# EAGLE design PIC18F4550 Ref3-Mod (EAGLE 7.3.0)
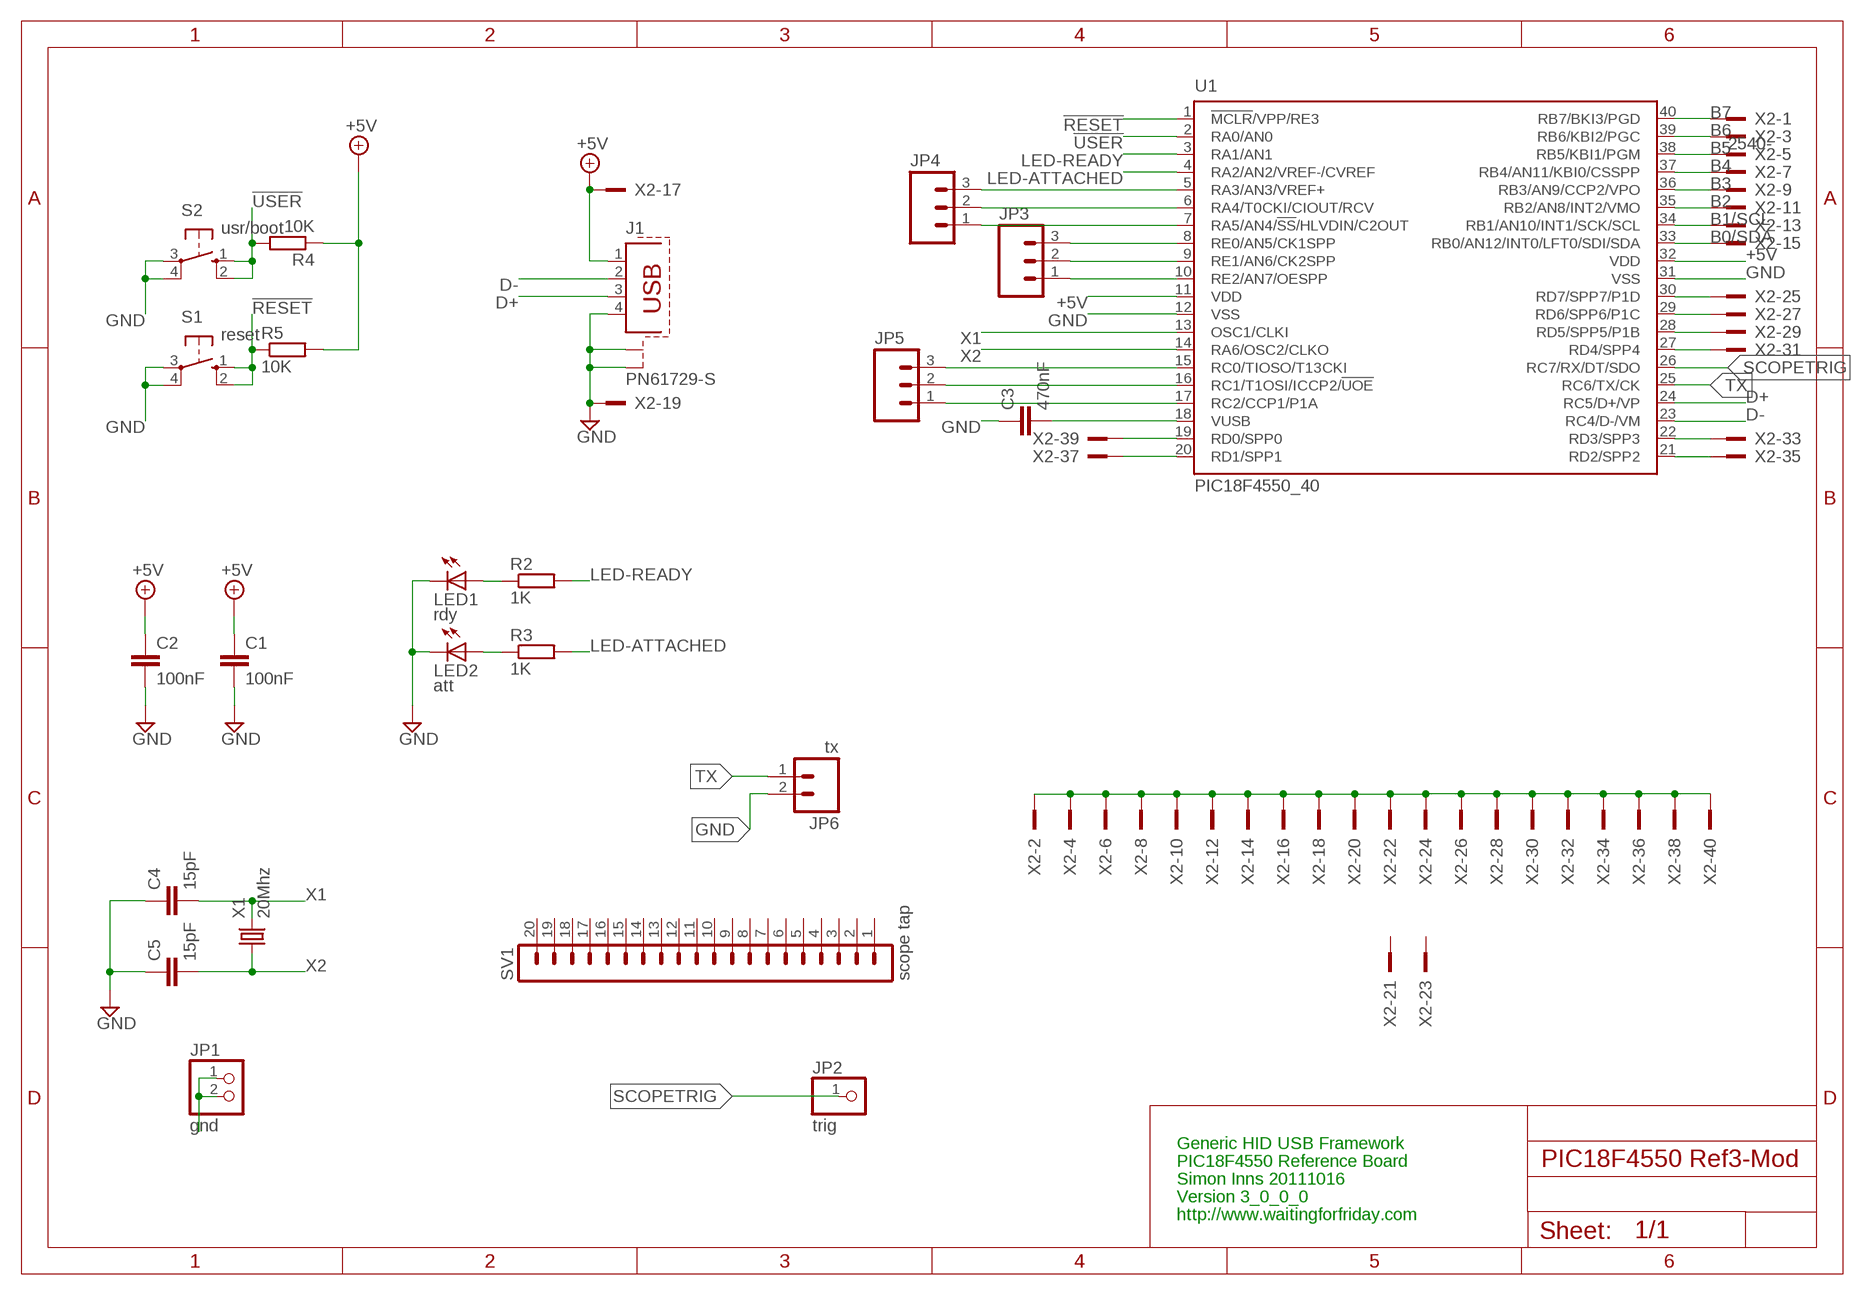
[diagram p0: schematic, sheet 1]

## Parts
C1  100nF  C-EU025-025X050  [C025-025X050]
C2  100nF  C-EU025-025X050  [C025-025X050]
C3  470nF  C-EU025-025X050  [C025-025X050]
C4  15pF  C-EU050-024X044  [C050-024X044]
C5  15pF  C-EU050-024X044  [C050-024X044]
J1  PN61729-S  [PN61729-S]
JP1  gnd  PINHD-1X2  [1X02]
JP2  trig  PINHD-1X1  [1X01]
JP3  M03PTH  [1X03]
JP4  M03PTH  [1X03]
JP5  M03PTH  [1X03]
JP6  tx  M02PTH  [1X02]
LED1  rdy  LED3MM  [LED3MM]
LED2  att  LED3MM  [LED3MM]
R2  1K  R-EU_0207/10  [0207/10]
R3  1K  R-EU_0207/10  [0207/10]
R4  10K  R-EU_0207/10  [0207/10]
R5  10K  R-EU_0207/10  [0207/10]
S1  reset  10-XX  [B3F-10XX]
S2  usr/boot  10-XX  [B3F-10XX]
SV1  scope tap  MA20-1  [MA20-1]
U1  PIC18F4550_40  [DIL40]
X1  20Mhz  CRYSTALHC49U-V  [HC49U-V]
X2  2540-  [PAK100/2500-40]

## Nets
!RESET: R5.1 S1.1(S) S1.2(S1) U1.1(!MCLR!/VPP/RE3)
!USER: R4.2 S2.1(S) S2.2(S1) U1.2(RA0/AN0)
+5V: C1.1 C2.1 J1.1 R4.1 R5.2 U1.11(VDD) U1.32(VDD) X2.17
B0/SDA: U1.33(RB0/AN12/INT0/LFT0/SDI/SDA) X2.15
B1/SCL: U1.34(RB1/AN10/INT1/SCK/SCL) X2.13
B2: U1.35(RB2/AN8/INT2/VMO) X2.11
B3: U1.36(RB3/AN9/CCP2/VPO) X2.9
B4: U1.37(RB4/AN11/KBI0/CSSPP) X2.7
B5: U1.38(RB5/KBI1/PGM) X2.5
B6: U1.39(RB6/KBI2/PGC) X2.3
B7: U1.40(RB7/BKI3/PGD) X2.1
D+: J1.3 U1.24(RC5/D+/VP)
D-: J1.2 U1.23(RC4/D-/VM)
GND: C1.2 C2.2 C3.1 C4.1 C5.1 J1.4 J1.S1 J1.S2 JP1.1 JP1.2 JP6.2 LED1.K(C) LED2.K(C) S1.3(P) S1.4(P1) S2.3(P) S2.4(P1) U1.12(VSS) U1.31(VSS) X2.2 X2.4 X2.6 X2.8 X2.10 X2.12 X2.14 X2.16 X2.18 X2.19 X2.20 X2.22 X2.24 X2.26 X2.28 X2.30 X2.32 X2.34 X2.36 X2.38 X2.40
LED-ATTACHED: R3.2 U1.4(RA2/AN2/VREF-/CVREF)
LED-READY: R2.2 U1.3(RA1/AN1)
N$1: U1.19(RD0/SPP0) X2.39
N$2: LED1.A R2.1
N$3: LED2.A R3.1
N$4: U1.20(RD1/SPP1) X2.37
N$5: U1.30(RD7/SPP7/P1D) X2.25
N$6: U1.29(RD6/SPP6/P1C) X2.27
N$7: U1.28(RD5/SPP5/P1B) X2.29
N$8: U1.27(RD4/SPP4) X2.31
N$9: U1.22(RD3/SPP3) X2.33
N$10: U1.21(RD2/SPP2) X2.35
N$11: C3.2 U1.18(VUSB)
N$12: JP3.1 U1.10(RE2/AN7/OESPP)
N$13: JP3.2 U1.9(RE1/AN6/CK2SPP)
N$14: JP3.3 U1.8(RE0/AN5/CK1SPP)
N$15: JP4.1 U1.7(RA5/AN4/!SS!/HLVDIN/C2OUT)
N$16: JP4.2 U1.6(RA4/T0CKI/CIOUT/RCV)
N$17: JP4.3 U1.5(RA3/AN3/VREF+)
N$18: JP5.1 U1.17(RC2/CCP1/P1A)
N$19: JP5.2 U1.16(RC1/T1OSI/ICCP2/!UOE)
N$20: JP5.3 U1.15(RC0/TIOSO/T13CKI)
SCOPETRIG: JP2.1 U1.26(RC7/RX/DT/SDO)
TX: JP6.1 U1.25(RC6/TX/CK)
X1: C4.2 U1.13(OSC1/CLKI) X1.2
X2: C5.2 U1.14(RA6/OSC2/CLKO) X1.1
Unconnected: SV1.1 SV1.2 SV1.3 SV1.4 SV1.5 SV1.6 SV1.7 SV1.8 SV1.9 SV1.10 SV1.11 SV1.12 SV1.13 SV1.14 SV1.15 SV1.16 SV1.17 SV1.18 SV1.19 SV1.20 X2.21 X2.23

## Notes on the sheet
- Generic HID USB Framework
- PIC18F4550 Reference Board
- Simon Inns 20111016
- Version 3_0_0_0
- http://www.waitingforfriday.com

## Library data of the parts
C1-C5 = rcl:C-EU: CAPACITOR, European symbol
J1 = con-berg:PN61729-S: BERG USB connector; OC_FARNELL: unknown; OC_NEWARK: unknown
JP1 = pinhead:PINHD-1X2: PIN HEADER
JP2 = pinhead:PINHD-1X1: PIN HEADER
JP3-JP5 = SparkFun:M03: Header 3 Standard 3-pin 0.1" header. Use with straight break away headers (SKU : PRT-00116), right angle break away headers (PRT-00553), swiss pins (PRT-00743), machine pins (PRT-00117), and female headers (PRT-00115). Molex polarized connector foot print use with SKU : PRT-08232 with associated crimp pins and housings.
JP6 = SparkFun:M02: Header 2 Standard 2-pin 0.1" header. Use with straight break away headers (SKU : PRT-00116), right angle break away headers (PRT-00553), swiss pins (PRT-00743), machine pins (PRT-00117), and female headers (PRT-00115). Molex polarized connector foot print use with SKU : PRT-08233 with associated crimp pins and housings.
LED1 LED2 = led:LED: LED OSRAM: - CHIPLED LG R971, LG N971, LY N971, LG Q971, LY Q971, LO R971, LY R971 LH N974, LH R974 LS Q976, LO Q976, LY Q976 LO Q996 - Hyper CHIPLED LW Q18S LB Q993, LB Q99A, LB R99A - SideLED LS A670, LO A670, LY A670, LG A670, LP A670 LB A673, LV A673, LT A673, LW A673 LH A674 LY A675 LS A676, LA A676, LO A676, LY A676, LW A676 LS A679, LY A679, LG A679 - Hyper Micro SIDELED® LS Y876, LA Y876, LO Y876, LY Y876 LT Y87S - SmartLED LW L88C, LW L88S LB L89C, LB L89S, LG L890 LS L89K, LO L89K, LY L89K LS L896, LA L896, LO L896, LY L896 - TOPLED LS T670, LO T670, LY T670, LG T670, LP T670 LSG T670, LSP T670, LSY T670, LOP T670, LYG T670 LG T671, LOG T671, LSG T671 LB T673, LV T673, LT T673, LW T673 LH T674 LS T676, LA T676, LO T676, LY T676, LB T676, LH T676, LSB T676, LW T676 LB T67C, LV T67C, LT T67C, LS T67K, LO T67K, LY T67K, LW E67C LS E67B, LA E67B, LO E67B, LY E67B, LB E67C, LV E67C, LT E67C LW T67C LS T679, LY T679, LG T679 LS T770, LO T770, LY T770, LG T770, LP T770 LB T773, LV T773, LT T773, LW T773 LH T774 LS E675, LA E675, LY E675, LS T675 LS T776, LA T776, LO T776, LY T776, LB T776 LHGB T686 LT T68C, LB T68C - Hyper Mini TOPLED® LB M676 - Mini TOPLED Santana® LG M470 LS M47K, LO M47K, LY M47K Source: http://www.osram.convergy.de LUXEON: - LUMILED® LXK2-PW12-R00, LXK2-PW12-S00, LXK2-PW14-U00, LXK2-PW14-V00 LXK2-PM12-R00, LXK2-PM12-S00, LXK2-PM14-U00 LXK2-PE12-Q00, LXK2-PE12-R00, LXK2-PE12-S00, LXK2-PE14-T00, LXK2-PE14-U00 LXK2-PB12-K00, LXK2-PB12-L00, LXK2-PB12-M00, LXK2-PB14-N00, LXK2-PB14-P00, LXK2-PB14-Q00 LXK2-PR12-L00, LXK2-PR12-M00, LXK2-PR14-Q00, LXK2-PR14-R00 LXK2-PD12-Q00, LXK2-PD12-R00, LXK2-PD12-S00 LXK2-PH12-R00, LXK2-PH12-S00 LXK2-PL12-P00, LXK2-PL12-Q00, LXK2-PL12-R00 Source: www.luxeon.com KINGBRIGHT: KA-3528ASYC Source: www.kingbright.com
R2-R5 = rcl:R-EU_: RESISTOR, European symbol
S1 S2 = switch-omron:10-XX: OMRON SWITCH; MPN: B3F-1000; OC_FARNELL: 176432; OC_NEWARK: 36M3542
SV1 = con-lstb:MA20-1: PIN HEADER; OC_FARNELL: unknown; OC_NEWARK: unknown
U1 = microchip:PIC18F4*_40: USB Microcontrollers with nanoWatt Technology High-Performance, Enhanced Flash, 28/40/44-Pin, Source: http://ww1.microchip.com/downloads/en/devicedoc/39632c.pdf; MF: MICROCHIP; MPN: PIC18F4550-I/P; OC_FARNELL: 9321357; OC_NEWARK: 74K8623
X1 = crystal:CRYSTAL: CRYSTAL; OC_FARNELL: 1666969; OC_NEWARK: unknown
X2 = con-3m:2540-: 3M (TM) Pak 100 4-Wall Header Source: 3M; OC_FARNELL: unknown; OC_NEWARK: unknown

## Board
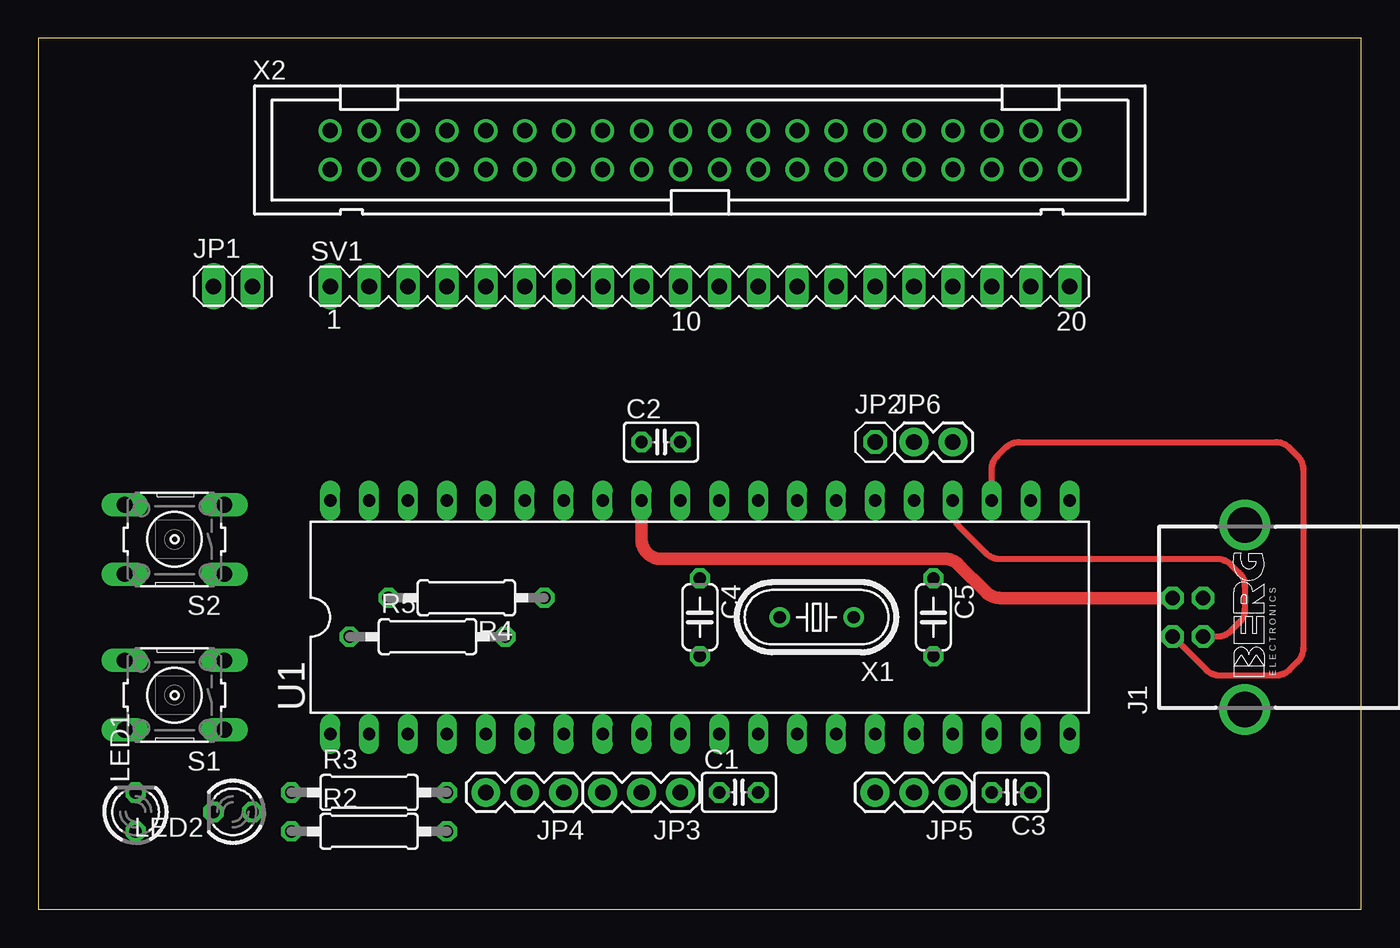
[diagram p1: board, top side]
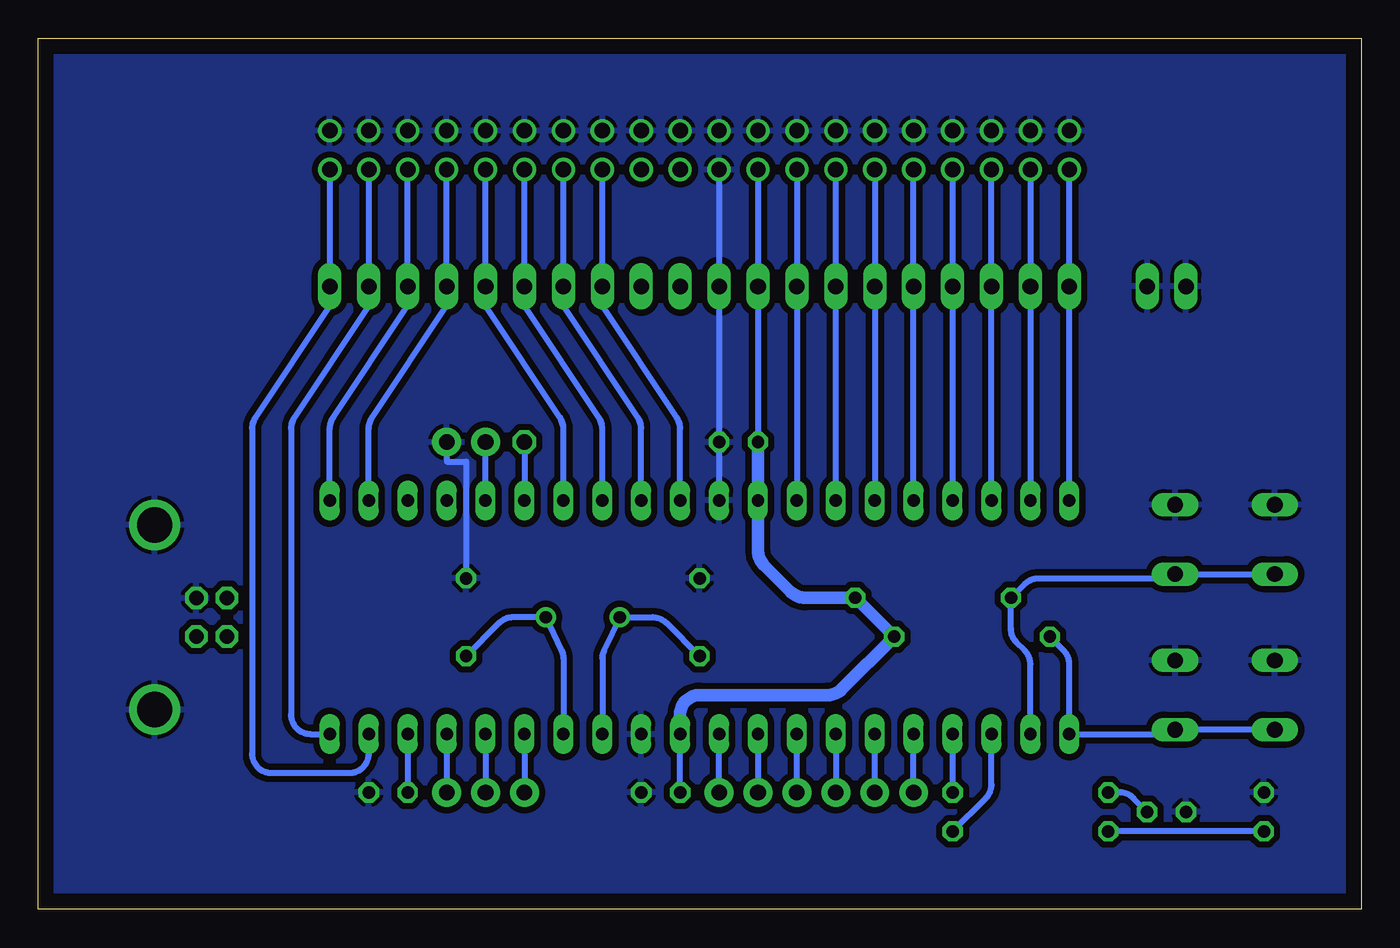
[diagram p2: board, bottom side, seen from below]

Size 86.34 x 56.82 mm. Coordinates in mm from the lower left corner, seen from the top.
Outline: 0,0 86.34,0 86.34,56.82 0,56.82 0,0
Copper layers (1*16): Top 0.035mm / dielectric 1.5mm / Bottom 0.035mm
Design rules "default": minimum track width 10mil, minimum drill 24mil, track to track 8mil, track to pad 8mil, pad to pad 8mil, via to via 8mil, smd to smd 8mil, copper to edge 40mil, drill to drill 8mil, minimum pad ring 10mil, minimum via ring 8mil, stop-mask expansion 4mil, vias tented up to drill 0mil, thermal gap 10mil

### Footprints (pad centres in the part's own frame; a part is rotated, then mirrored left to right if it is on the bottom)
C025-025X050 = drill 0.813 octagon: 1 -1.27,0; 2 1.27,0
C050-024X044 = drill 0.813 octagon: 1 -2.54,0; 2 2.54,0
PN61729-S = drill 0.95 octagon: 1 1.25,4.71; 2 -1.25,4.71; 3 -1.25,2.71; 4 1.25,2.71 | drill 2.3 pad 2.9: S1 -6.02,0; S2 6.02,0
1X02 = drill 1.016 long: 1 -1.27,0; 2 1.27,0
1X01 = drill 1.016 octagon: 1 0,0
1X03 = drill 1.016 pad 1.88: 1 0,0; 2 2.54,0; 3 5.08,0
1X02' = drill 1.016 pad 1.88: 1 0,0; 2 2.54,0
LED3MM = drill 0.813 octagon: A -1.27,0; K 1.27,0
0207/10 = drill 0.813 octagon: 1 -5.08,0; 2 5.08,0
B3F-10XX = drill 1.016 long: 1 -3.251,2.261; 2 3.251,2.261; 3 -3.251,-2.261; 4 3.251,-2.261
MA20-1 = drill 1.016 long: 1 -24.13,0; 2 -21.59,0; 3 -19.05,0; 4 -16.51,0; 5 -13.97,0; 6 -11.43,0; 7 -8.89,0; 8 -6.35,0; 9 -3.81,0; 10 -1.27,0; 11 1.27,0; 12 3.81,0; 13 6.35,0; 14 8.89,0; 15 11.43,0; 16 13.97,0; 17 16.51,0; 18 19.05,0; 19 21.59,0; 20 24.13,0
DIL40 = drill 0.813 long: 1 -24.13,-7.62; 2 -21.59,-7.62; 3 -19.05,-7.62; 4 -16.51,-7.62; 5 -13.97,-7.62; 6 -11.43,-7.62; 7 -8.89,-7.62; 8 -6.35,-7.62; 9 -3.81,-7.62; 10 -1.27,-7.62; 11 1.27,-7.62; 12 3.81,-7.62; 13 6.35,-7.62; 14 8.89,-7.62; 15 11.43,-7.62; 16 13.97,-7.62; 17 16.51,-7.62; 18 19.05,-7.62; 19 21.59,-7.62; 20 24.13,-7.62; 21 24.13,7.62; 22 21.59,7.62; 23 19.05,7.62; 24 16.51,7.62; 25 13.97,7.62; 26 11.43,7.62; 27 8.89,7.62; 28 6.35,7.62; 29 3.81,7.62; 30 1.27,7.62; 31 -1.27,7.62; 32 -3.81,7.62; 33 -6.35,7.62; 34 -8.89,7.62; 35 -11.43,7.62; 36 -13.97,7.62; 37 -16.51,7.62; 38 -19.05,7.62; 39 -21.59,7.62; 40 -24.13,7.62
HC49U-V = drill 0.813: 1 -2.413,0; 2 2.413,0
PAK100/2500-40 = drill 1 pad 1.422: 1 -24.13,-1.27; 2 -24.13,1.27; 3 -21.59,-1.27; 4 -21.59,1.27; 5 -19.05,-1.27; 6 -19.05,1.27; 7 -16.51,-1.27; 8 -16.51,1.27; 9 -13.97,-1.27; 10 -13.97,1.27; 11 -11.43,-1.27; 12 -11.43,1.27; 13 -8.89,-1.27; 14 -8.89,1.27; 15 -6.35,-1.27; 16 -6.35,1.27; 17 -3.81,-1.27; 18 -3.81,1.27; 19 -1.27,-1.27; 20 -1.27,1.27; 21 1.27,-1.27; 22 1.27,1.27; 23 3.81,-1.27; 24 3.81,1.27; 25 6.35,-1.27; 26 6.35,1.27; 27 8.89,-1.27; 28 8.89,1.27; 29 11.43,-1.27; 30 11.43,1.27; 31 13.97,-1.27; 32 13.97,1.27; 33 16.51,-1.27; 34 16.51,1.27; 35 19.05,-1.27; 36 19.05,1.27; 37 21.59,-1.27; 38 21.59,1.27; 39 24.13,-1.27; 40 24.13,1.27

### Placement (x,y rotation side)
C1  45.72,7.62 0 top
C2  40.64,30.48 0 top
C3  63.5,7.62 180 top
C4  43.18,19.05 270 top
C5  58.42,19.05 270 top
J1  78.74,19.05 90 top
JP1  12.7,40.64 0 top
JP2  54.61,30.48 0 top
JP3  41.91,7.62 180 top
JP4  34.29,7.62 180 top
JP5  59.69,7.62 180 top
JP6  tx  [1X02']  57.15,30.48 0 top
LED1  6.35,6.35 90 top
LED2  12.7,6.35 180 top
R2  21.59,5.08 0 top
R3  21.59,7.62 0 top
R4  27.94,20.32 180 top
R5  25.4,17.78 0 top
S1  8.89,13.97 180 top
S2  8.89,24.13 180 top
SV1  43.18,40.64 0 top
U1  43.18,19.05 0 top
X1  50.8,19.05 180 top
X2  43.18,49.53 0 top

### Tracks (layer width: path | path; a pad name or v marks a point on that pad's centre or on a via)
!RESET
  Bottom 0.406: S1.2 S1.1 12.42,11.43 U1.1 19.05,15.98 arc-45 19.42,16.88 R5.1
!USER
  Bottom 0.406: S2.2 S2.1 12.42,21.59 21.06,21.59 arc-45 21.96,21.22 R4.2 22.86,18.31 arc-45 22.49,17.41 21.96,16.88 arc45 21.59,15.98 U1.2
+5V
  Top 0.813: J1.1 62.78,20.3 arc-45 61.88,20.67 60.06,22.49 arc45 59.16,22.86 40.64,22.86 arc-90 39.37,24.13 U1.32
  Bottom 0.406: C1.1 U1.11 | X2.17 C2.1
  Bottom 0.813: C2.1 U1.32 39.37,23.39 arc-45 39,22.49 37.2,20.69 arc-45 36.3,20.32 R4.1 R5.2 33.92,14.34 arc45 34.82,13.97 43.18,13.97 arc-90 44.45,12.7 U1.11
B0/SDA
  Bottom 0.406: X2.15 U1.33
B1/SCL
  Bottom 0.406: U1.34 X2.13
B2
  Bottom 0.406: X2.11 U1.35
B3
  Bottom 0.406: U1.36 X2.9
B4
  Bottom 0.406: X2.7 U1.37
B5
  Bottom 0.406: U1.38 X2.5
B6
  Bottom 0.406: X2.3 U1.39
B7
  Bottom 0.406: U1.40 X2.1
D+
  Top 0.406: U1.24 59.69,25.93 arc45 60.06,25.03 61.86,23.23 arc45 62.76,22.86 76.94,22.86 arc-45 77.84,22.49 78.37,21.96 arc-45 78.74,21.06 78.74,19.58 arc-45 78.37,18.68 77.84,18.15 arc-45 76.94,17.78 76.08,17.78 arc-45 J1.3
D-
  Top 0.406: U1.23 62.23,28.68 arc-45 62.6,29.58 63.13,30.11 arc-45 64.03,30.48 80.75,30.48 arc-45 81.65,30.11 82.18,29.58 arc-45 82.55,28.68 82.55,17.04 arc-45 82.18,16.14 81.65,15.61 arc-45 80.75,15.24 77.12,15.24 arc-45 76.22,15.61 J1.2
GND
  Bottom 0.406: X2.19 U1.31 | JP6.2 59.69,29.21 58.42,29.21 C5.1
  pour Bottom (isolate 0.406): 0,57.15 86.36,57.15 86.36,0 0,0
LED-ATTACHED
  Bottom 0.406: U1.4 R3.2
LED-READY
  Bottom 0.406: R2.2 24.5,7.25 arc-45 24.13,8.15 U1.3
N$1
  Bottom 0.406: X2.39 67.31,39.37 72.18,32.07 arc-34 72.39,31.36 72.39,10.16 arc-90 71.12,8.89 66.04,8.89 arc-90 64.77,10.16 U1.19
N$2
  Bottom 0.406: LED1.A R2.1
N$3
  Bottom 0.406: LED2.A 14.87,7.25 arc-45 15.77,7.62 R3.1
N$4
  Bottom 0.406: X2.37 64.77,39.37 69.64,32.07 arc-34 69.85,31.36 69.85,12.7 arc-90 68.58,11.43 U1.20
N$5
  Bottom 0.406: U1.30 44.45,31.36 arc-34 44.66,32.07 49.53,39.37 X2.25
N$6
  Bottom 0.406: U1.29 46.99,31.36 arc-34 47.2,32.07 52.07,39.37 X2.27
N$7
  Bottom 0.406: U1.28 49.53,31.36 arc-34 49.74,32.07 54.61,39.37 X2.29
N$8
  Bottom 0.406: U1.27 52.07,31.36 arc-34 52.28,32.07 57.15,39.37 X2.31
N$9
  Bottom 0.406: U1.22 64.77,31.36 arc34 64.56,32.07 59.69,39.37 X2.33
N$10
  Bottom 0.406: U1.21 67.31,31.36 arc34 67.1,32.07 62.23,39.37 X2.35
N$11
  Bottom 0.406: U1.18 C3.2
N$12
  Bottom 0.406: JP3.1 U1.10
N$13
  Bottom 0.406: U1.9 JP3.2
N$14
  Bottom 0.406: JP3.3 U1.8
N$15
  Bottom 0.406: U1.7 JP4.1
N$16
  Bottom 0.406: JP4.2 U1.6
N$17
  Bottom 0.406: JP4.3 U1.5
N$18
  Bottom 0.406: U1.17 JP5.1
N$19
  Bottom 0.406: U1.16 JP5.2
N$20
  Bottom 0.406: U1.15 JP5.3
SCOPETRIG
  Bottom 0.406: JP2.1 U1.26
TX
  Bottom 0.406: U1.25 JP6.1
X1
  Bottom 0.406: U1.13 49.53,16.35 arc25 49.41,16.89 X1.2 46.25,19.05 arc45 45.35,18.68 C4.2
X2
  Bottom 0.406: U1.14 52.07,16.35 arc-25 52.19,16.89 X1.1 55.35,19.05 arc-45 56.25,18.68 C5.2

### Text on the board
tDocu: 1